# EasyEDA Pro project hanger0515.eprj

# Schematic Schematic1
Create Date: 2024-05-15; Page Name: P1; Project Name: hanger0515; Schematic Name: Schematic1; Update Date: 2024-05-15; Company: 嘉立创EDA; Page Size: A4; Version: V1.0
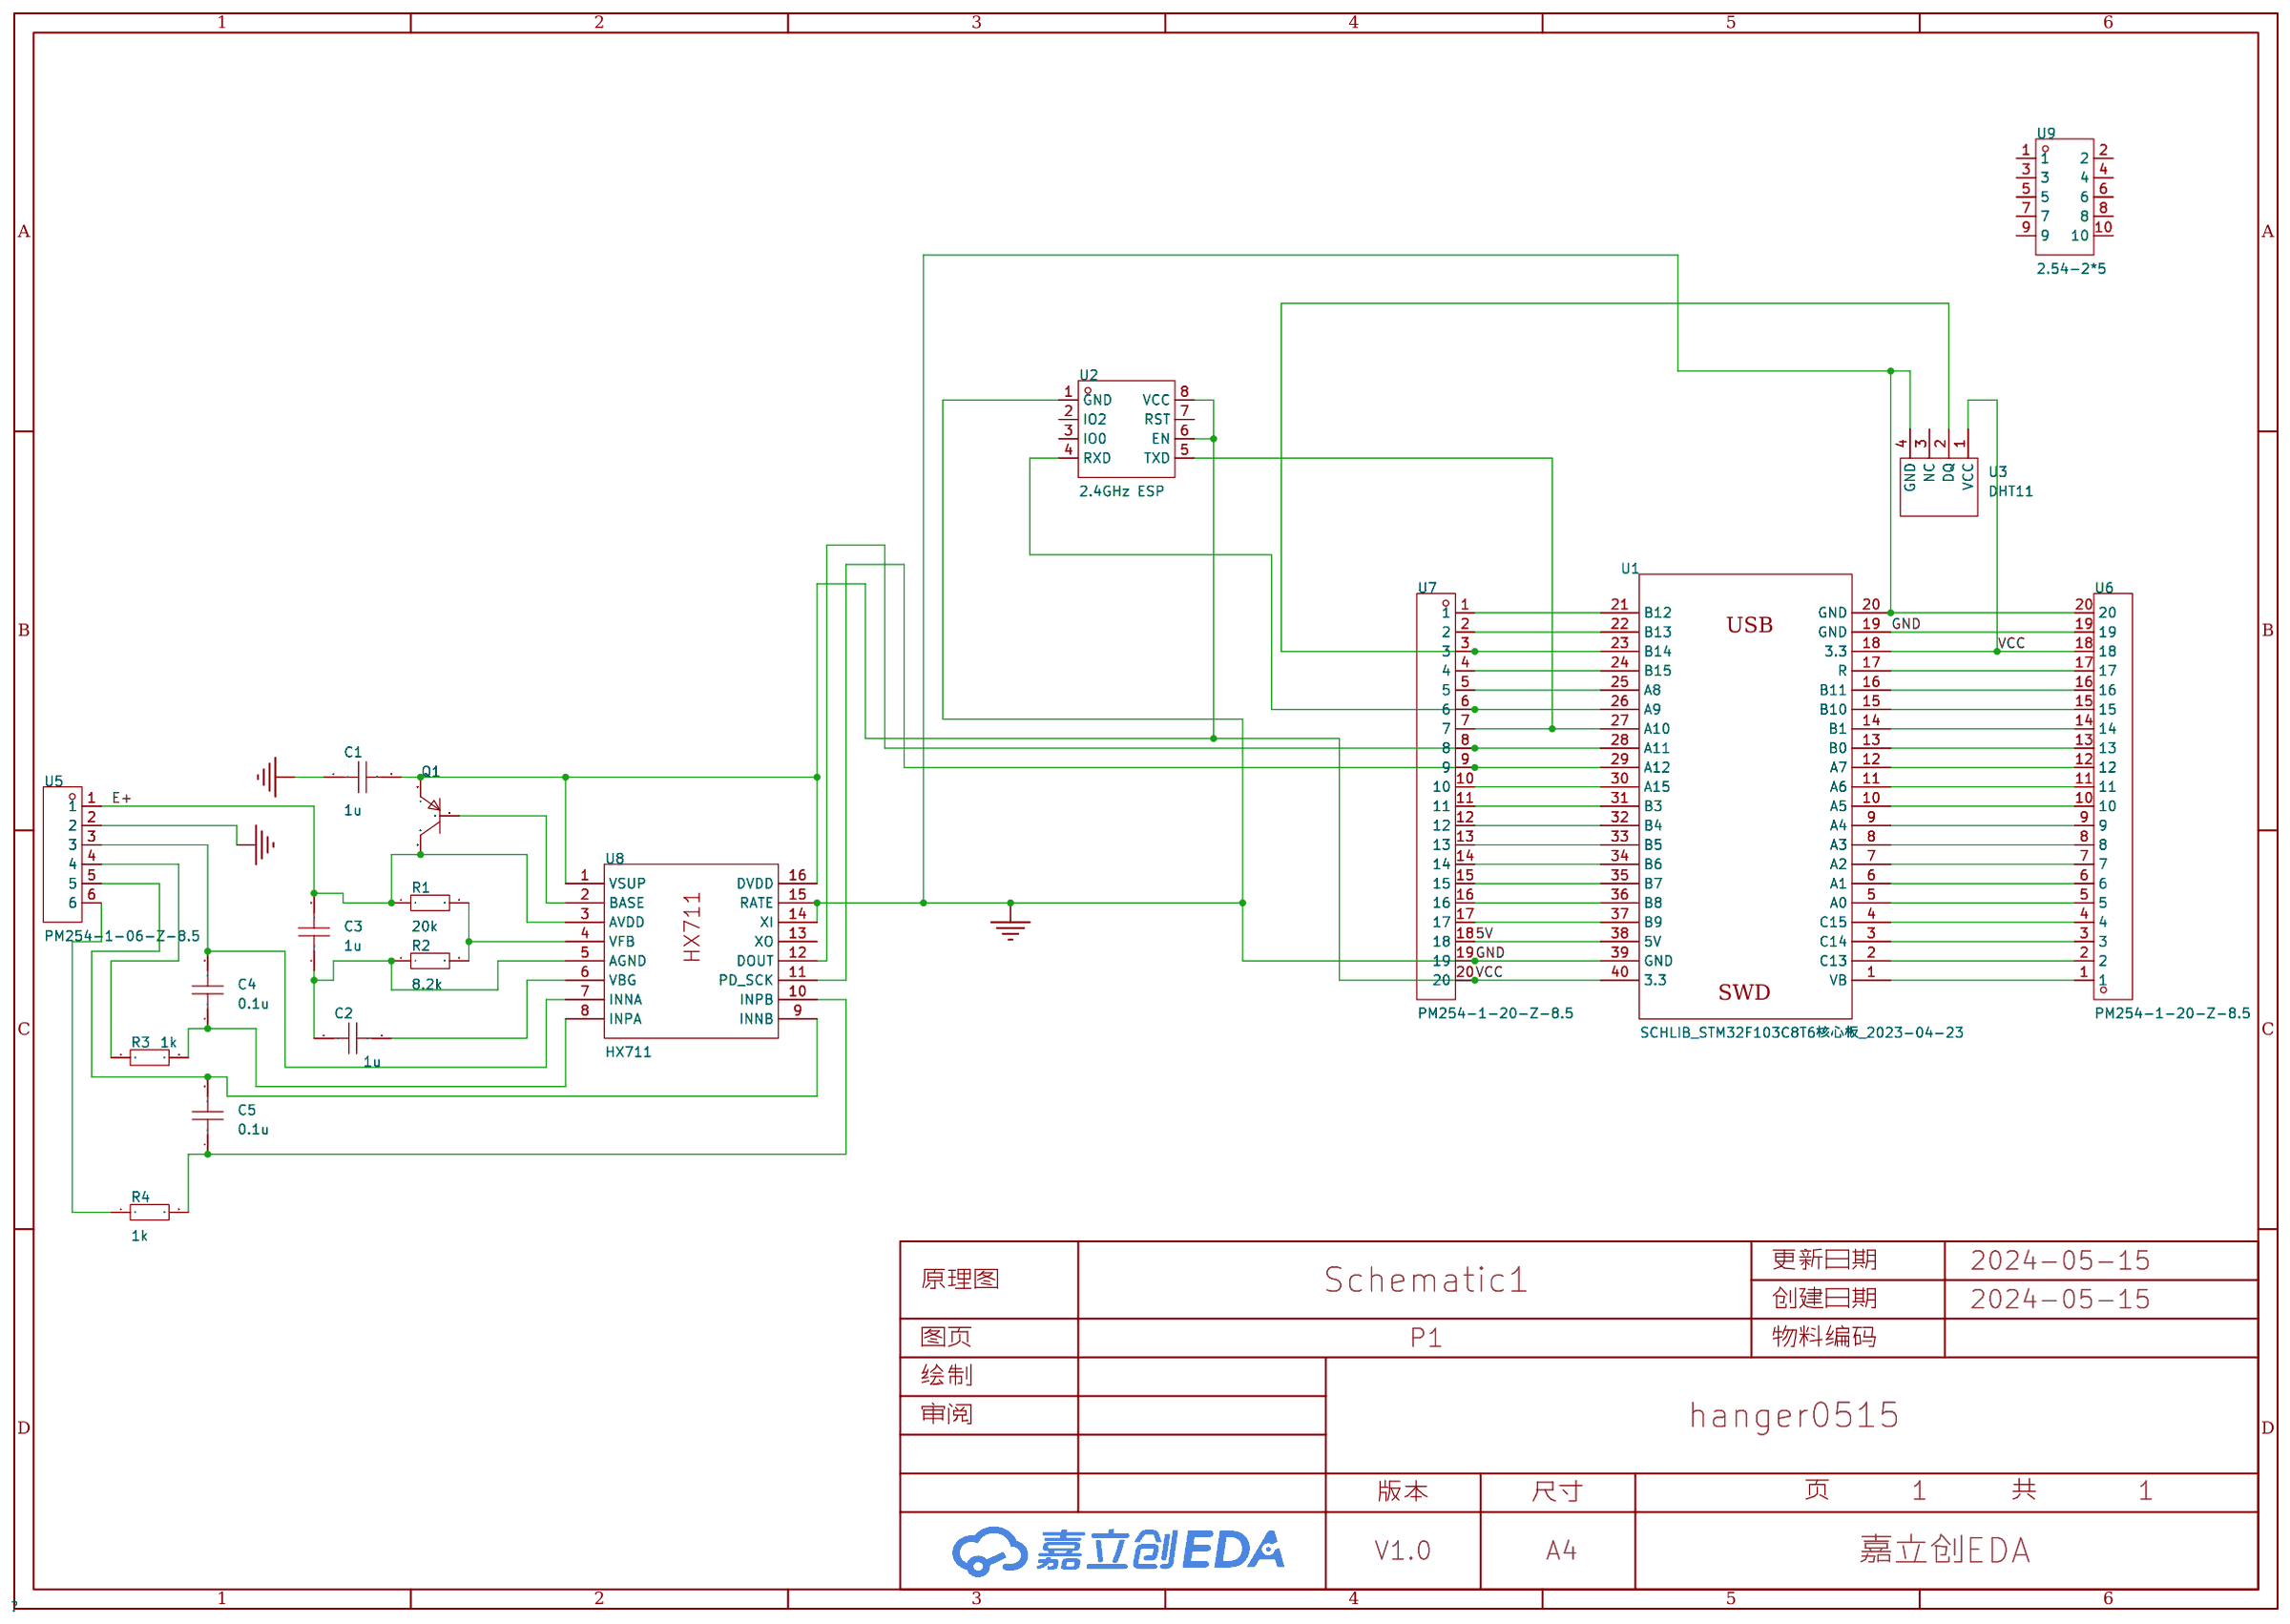
[diagram p0: schematic sheet]

## Parts
C1  1u  [C0603]
C2  1u  [C0603]
C3  1u  [C0603]
C4  0.1u  [C0603]
C5  0.1u  [C0603]
Q1  -  [S8550P_SOT]
R1  20k  [R0603]
R2  8.2k  [R0603]
R3  1k  [R0603]
R4  1k  [R0603]
U1  SCHLIB_STM32F103C8T6核心板_2023-04-23  [STM32F103C8T6核心板 STM32开发板ARM嵌入式单片机小系统实验板]
U2  2.4GHz ESP  [WIFIM-TH_8P-L24.7-W14.4-P2.54]
U3  DHT11  [DHT11]
U5  PM254-1-06-Z-8.5  [HDR-TH_6P-P2.54-V-F]
U6  PM254-1-20-Z-8.5  [HDR-TH_20P-P2.54-V-F-2]
U7  PM254-1-20-Z-8.5  [HDR-TH_20P-P2.54-V-F-2]
U8  HX711  [SOP-16_L10.0-W3.9-P1.27-LS6.0-BL]
U9  2.54-2*5  [HDR-TH_10P-P2.54-V-F-R2-C5-S2.54]

## Library data of the parts
C1-C5 = CAP_0603: Supplier Footprint: 0603
Q1 = S8550_SOT_PNP: Supplier Footprint: SOT-23
R1-R4 = Res_0603: Supplier Footprint: 0603
U1 = SCHLIB_STM32F103C8T6核心板_2023-04-23: link: https://item.taobao.com/item.htm?spm=a1z0d.7625083.1998302264.6.5c5f4e69XYSnTr&id=620064088112
U2 = ESP-01: 核心处理器:-;频率:2.4GHz;天线形式:板载PCB天线;发射功率:16dBm;接收灵敏度:-90dBm;; LCSC Part Name: 体积超小的802.11b/g/nWi-FiSOC模块; Supplier Part: C503581; Manufacturer: Ai-Thinker(安信可); JLCPCB Part Class: Extended Part; Datasheet: https://atta.szlcsc.com/upload/public/pdf/source/20200407/C503581_BFDAA19F4B592DB0CEE4D61B6918C625.pdf; Supplier: LCSC; Support Interface: GPIO；UART; Antenna Type: 板载PCB天线; Output Power: 16dBm; Operating Voltage: 3V~3.6V; Sensitivity: -90dBm; Operating Temperature: -20℃~+85℃
U3 = DHT11: _: undefined
U5 = PM254-1-06-Z-8.5: 插孔结构:1x6P;间距:2.54mm;行距:-;圆孔/方孔:方孔;安装类型:直插;排数:单排;总孔位数:6P;额定电流:3A;额定电压:-;插孔方向:顶部;塑高:8.5mm;触头材质:铜合金;工作温度范围:-40℃~+105℃;焊接温度(最大值):260℃@5S;; LCSC Part Name: 1x6P 间距:2.54mm 直插; Supplier Part: C2897369; Manufacturer: HCTL(华灿天禄); Supplier Footprint: 插件,P=2.54mm; JLCPCB Part Class: Extended Part; Datasheet: https://atta.szlcsc.com/upload/public/pdf/source/20230609/534BE42964C679BDE98E061007C4ABD6.pdf; Supplier: LCSC; Holes Structure: 1x6P; Pitch: 2.54mm; Circular Hole / Square Hole: 方孔; Mounting Type: 直插; Number of Rows: 单排; Number of Holes: 6P; Current Rating (Max): 3A; Holes Direction: 顶部; Insulation Height: 8.5mm; Contact Material: 铜合金; Operating Temperature Range: -40℃~+105℃; Soldering Temperature(Max): 260℃@5S
U6 U7 = PM254-1-20-Z-8.5: 插孔结构:1x20P;间距:2.54mm;行距:-;圆孔/方孔:方孔;安装类型:直插;排数:单排;总孔位数:20P;额定电流:3A;额定电压:-;插孔方向:顶部;塑高:8.5mm;触头材质:铜合金;工作温度范围:-40℃~+105℃;焊接温度(最大值):260℃@5S;; LCSC Part Name: 1x20P 间距:2.54mm 直插; Supplier Part: C2897383; Manufacturer: HCTL(华灿天禄); Supplier Footprint: 插件,P=2.54mm; JLCPCB Part Class: Extended Part; Datasheet: https://atta.szlcsc.com/upload/public/pdf/source/20230609/534BE42964C679BDE98E061007C4ABD6.pdf; Supplier: LCSC; Holes Structure: 1x20P; Pitch: 2.54mm; Circular Hole / Square Hole: 方孔; Mounting Type: 直插; Number of Rows: 单排; Number of Holes: 20P; Current Rating (Max): 3A; Holes Direction: 顶部; Insulation Height: 8.5mm; Contact Material: 铜合金; Operating Temperature Range: -40℃~+105℃; Soldering Temperature(Max): 260℃@5S
U8 = HX711: 称重AD采集芯片; Supplier Part: C43656; Manufacturer: AVIA(海芯科技); Supplier Footprint: SOP-16; JLCPCB Part Class: Extended Part; Datasheet: https://atta.szlcsc.com/upload/public/pdf/source/20201105/C43656_14FD91CAE53E7DB415D03EABCB162D83.pdf; Supplier: LCSC
U9 = 2.54-2*5: 插孔结构:2x5P;间距:2.54mm;行距:2.54mm;圆孔/方孔:方孔;安装类型:直插;排数:双排;总孔位数:10P;额定电流:2.5A;额定电压:-;插孔方向:顶部;塑高:8.5mm;工作温度范围:-40℃~+105℃;; LCSC Part Name: 间距:2.54mm 2x5P 直插; Supplier Part: C2977587; Manufacturer: ZHOURI(洲日); Supplier Footprint: 插件,P=2.54mm; JLCPCB Part Class: Extended Part; Datasheet: https://atta.szlcsc.com/upload/public/pdf/source/20220328/53961E697C4FF664B69BABFADEC8B830.pdf; Supplier: LCSC; Holes Structure: 2x5P; Pitch: 2.54mm; Row Spacing: 2.54mm; Circular Hole / Square Hole: 方孔; Mounting Type: 直插; Number of Rows: 双排; Number of Holes: 10P; Current Rating (Max): 2.5A; Holes Direction: 顶部; Insulation Height: 8.5mm; Operating Temperature Range: -40℃~+105℃

## Nets
5V: U1.38(5V) U7.18
GND: C1.1 U1.19(GND) U1.20(GND) U1.39(GND) U2.1(GND) U3.4(GND) U5.2 U6.19 U6.20 U7.19 U8.14(XI) U8.15(RATE)
VCC: C1.2 Q1.2(E) U1.18(3.3) U1.40(3.3) U2.6(EN) U2.8(VCC) U3.1(VCC) U6.18 U7.20 U8.1(VSUP) U8.16(DVDD)
E+: C3.2 Q1.3(C) R1.1 U5.1 U8.3(AVDD)
$1N591: U1.23(B14) U3.2(DQ) U7.3
$1N598: U1.1(VB) U6.1
$1N599: U1.2(C13) U6.2
$1N600: U1.3(C14) U6.3
$1N601: U1.4(C15) U6.4
$1N602: U1.5(A0) U6.5
$1N603: U1.6(A1) U6.6
$1N604: U1.7(A2) U6.7
$1N605: U1.8(A3) U6.8
$1N606: U1.9(A4) U6.9
$1N607: U1.10(A5) U6.10
$1N608: U1.11(A6) U6.11
$1N609: U1.12(A7) U6.12
$1N610: U1.13(B0) U6.13
$1N611: U1.14(B1) U6.14
$1N612: U1.15(B10) U6.15
$1N613: U1.16(B11) U6.16
$1N614: U1.17(R) U6.17
$1N623: U1.26(A9) U2.4(RXD) U7.6
$1N624: U1.21(B12) U7.1
$1N625: U1.22(B13) U7.2
$1N626: U1.24(B15) U7.4
$1N627: U1.25(A8) U7.5
$1N628: U1.30(A15) U7.10
$1N629: U1.31(B3) U7.11
$1N630: U1.32(B4) U7.12
$1N631: U1.33(B5) U7.13
$1N632: U1.34(B6) U7.14
$1N633: U1.35(B7) U7.15
$1N635: U1.27(A10) U2.5(TXD) U7.7
$1N641: U1.36(B8) U7.16
$1N660: U1.37(B9) U7.17
$1N2019: Q1.1(B) U8.2(BASE)
$1N2037: R1.2 R2.2 U8.4(VFB)
$1N2057: C2.2 U8.6(VBG)
$1N2062: C2.1 C3.1 R2.1 U8.5(AGND)
$1N2095: C4.1 R3.2 U8.8(INPA)
$1N2099: C5.1 R4.2 U8.10(INPB)
$1N2122: C4.2 U5.3 U8.7(INNA)
$1N2126: R3.1 U5.4
$1N2137: C5.2 U5.5 U8.9(INNB)
$1N2144: R4.1 U5.6
$1N2211: U1.29(A12) U7.9 U8.11(PD_SCK)
$1N2222: U1.28(A11) U7.8 U8.12(DOUT)

Not connected (* = marked no-connect by the designer): U2 2(IO2) 3(IO0) 7(RST); U3 3(NC); U8 13(XO); U9 1 2 3 4 5 6 7 8 9 10

# Board PCB1
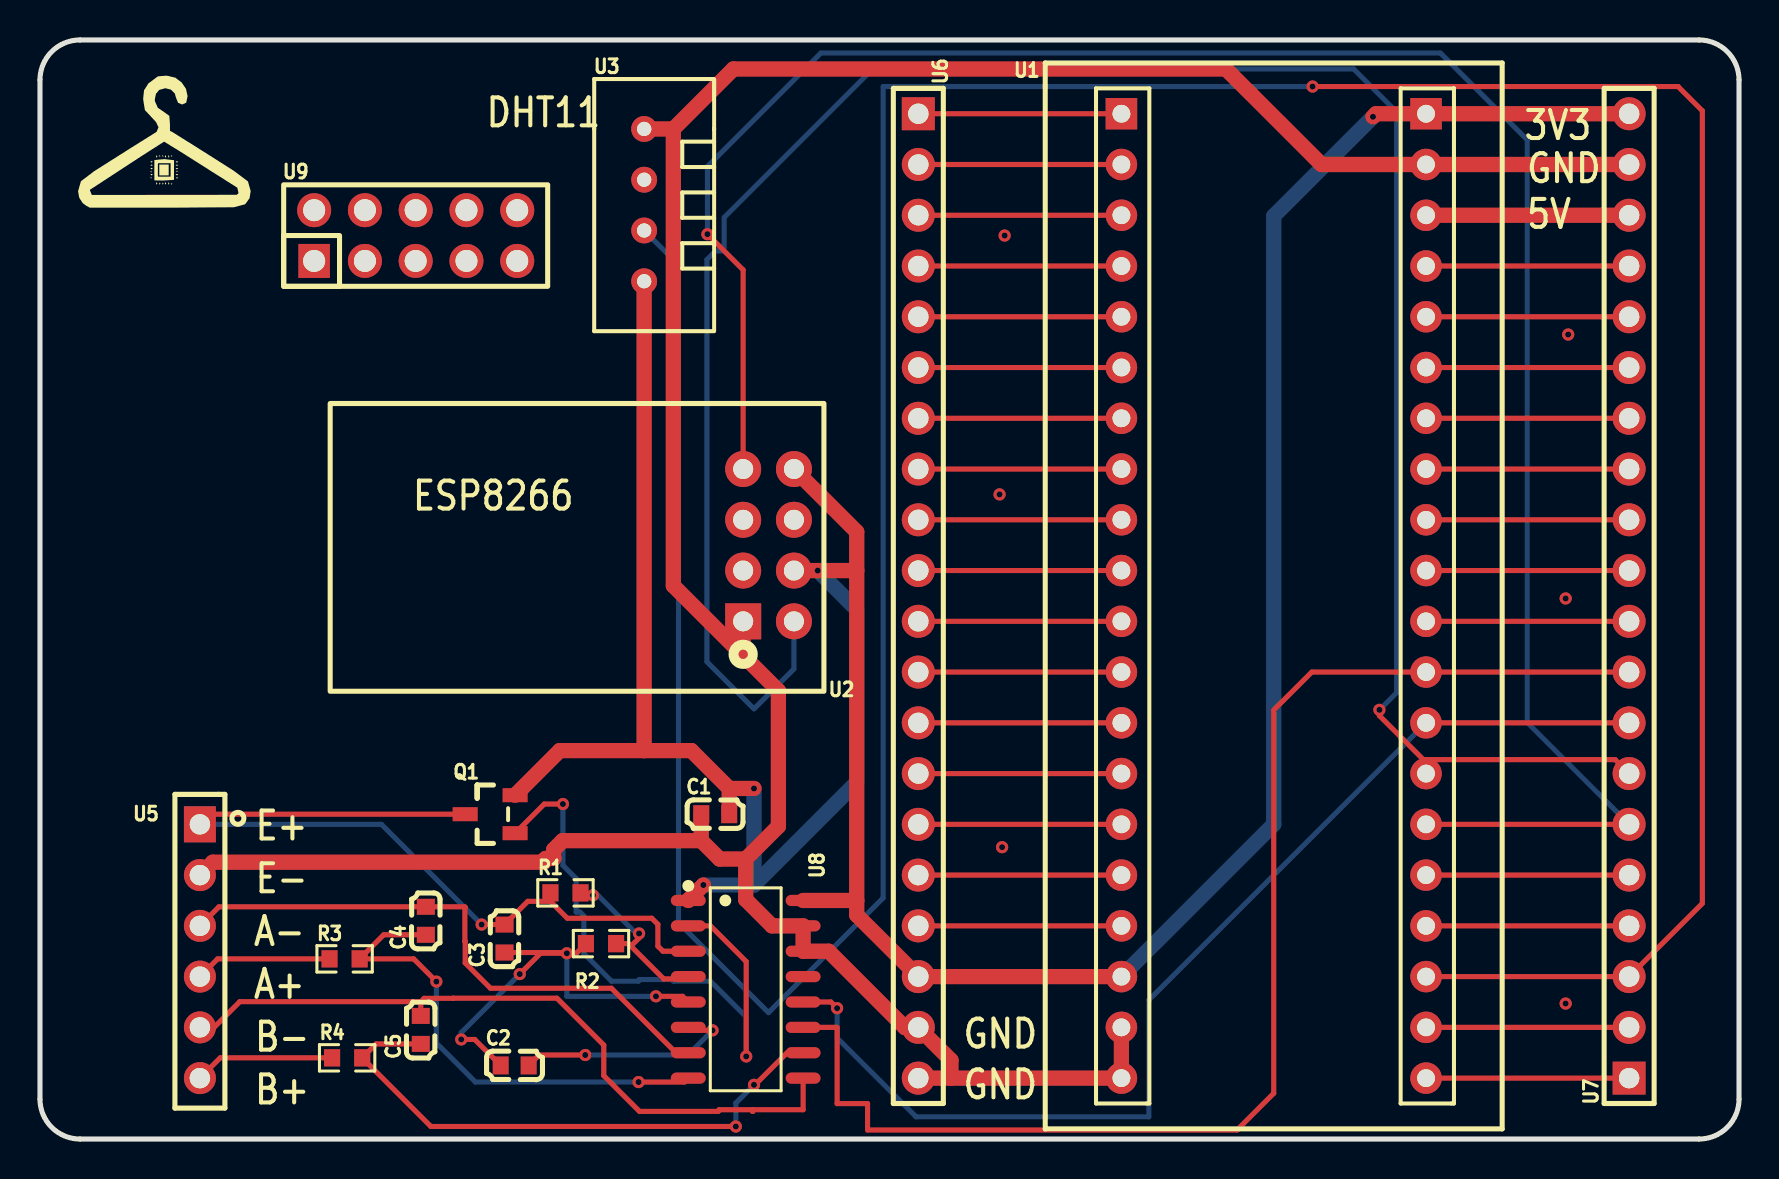
[diagram p1: board, top side]
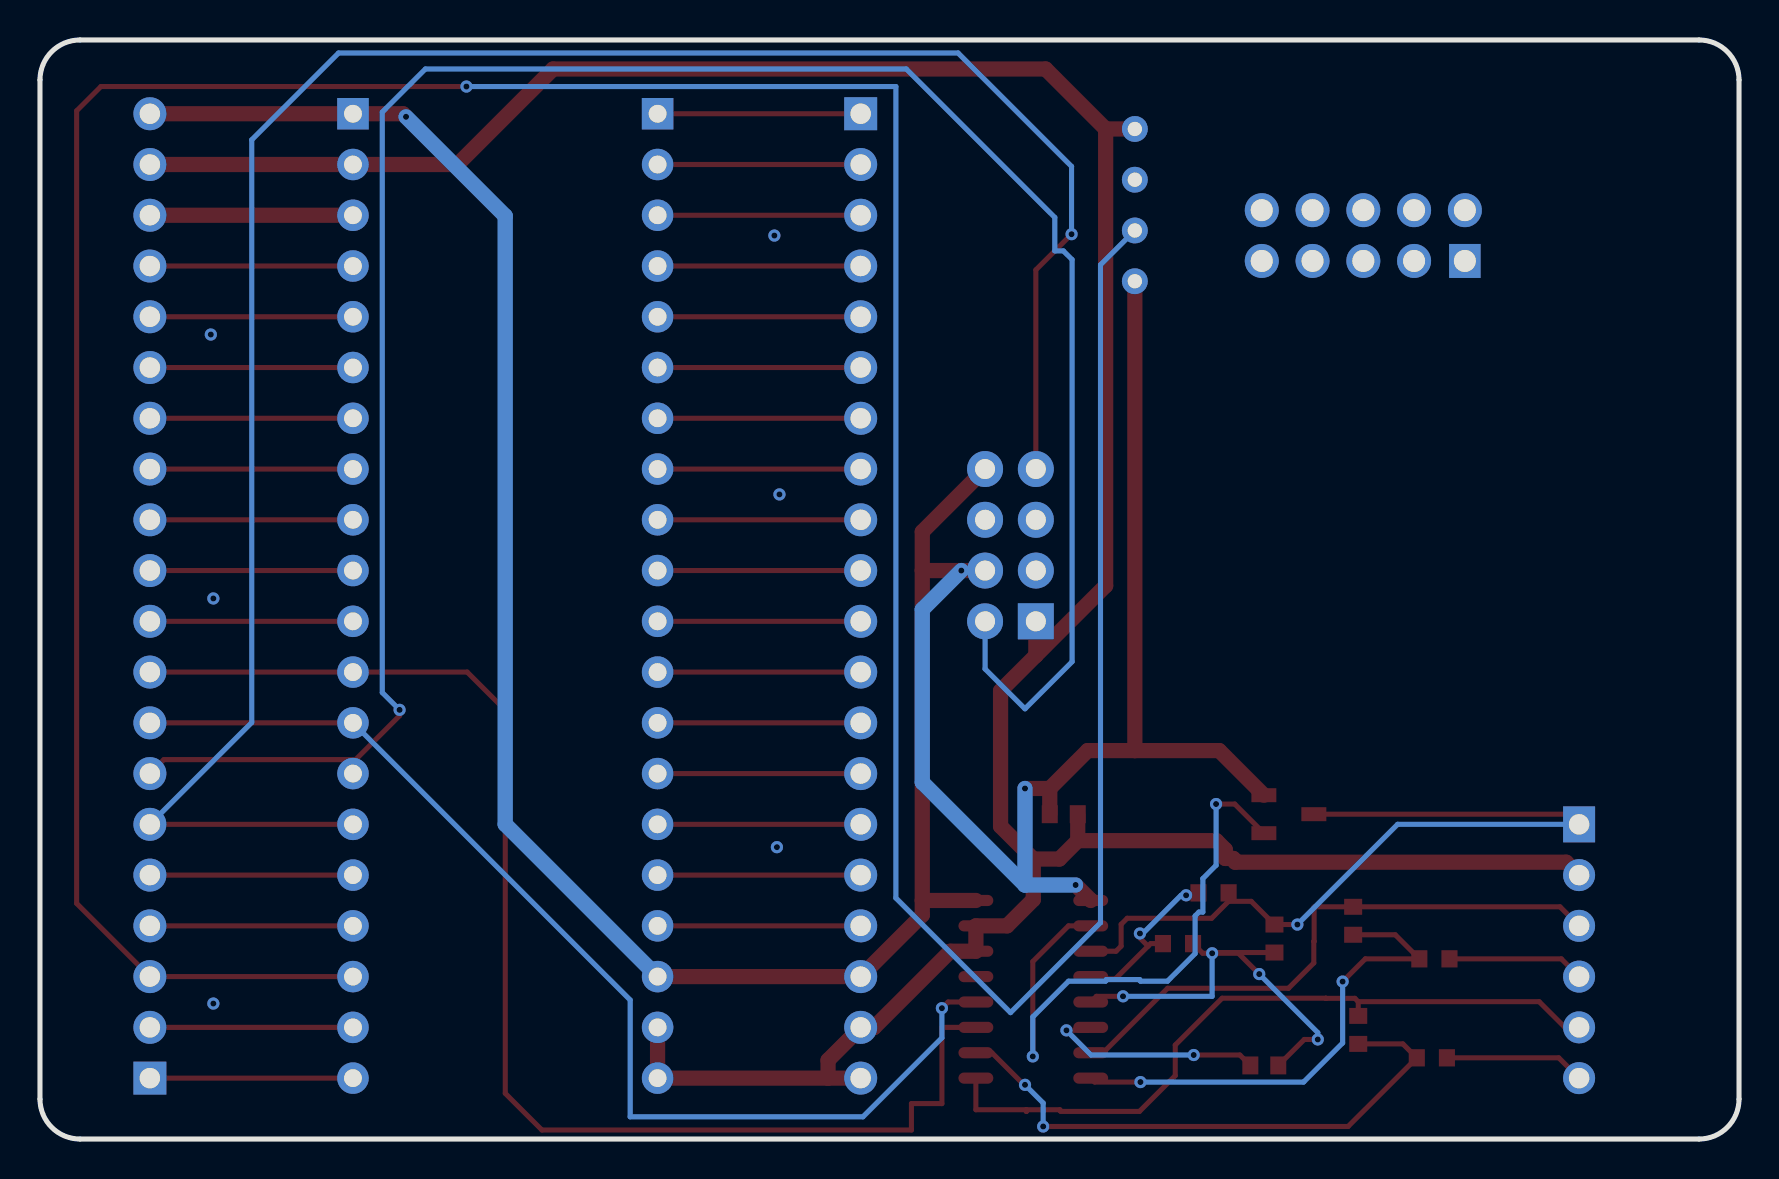
[diagram p2: board, bottom side, seen from below]

Outline 85 x 55 mm; copper layers: Top Layer, Bottom Layer. Coordinates in mm from the lower left corner of the outline.
Outline path: 0,53 0,2 arc(0.59,0.59) 2,0 83,0 arc(84.41,0.59) 85,2 85,53 arc(84.41,54.41) 83,55 2,55 arc(0.59,54.41) 0,53
Stack: Top Layer 0.035mm / Dielectric1 1.51mm FR4 er 4.5 / Bottom Layer 0.035mm

## Design rules (mm)
template: 自定义配置
spacing copperThickness1oz (default): track to track 0.203, other pairs 0.203 to 0.203
spacing copperThickness2oz: track to track 0.203, other pairs 0.152 to 0.3
track width copperThickness1oz (default): min 0.254, default 0.254, max 0.762
track width copperThickness2oz: min 0.203, default 0.254, max 2.54
track width VCCandGND: min 0.254, default 0.762, max 0.762
differential pair differentialPair (default): width min 0.127, default 0.254, max 2.54; gap min 0.152, default 0.152
via viaSize (default): diameter min 0.5, default 0.61, max 10; hole min 0.3, default 0.305, max 6.299
net GND uses VCCandGND
net VCC uses VCCandGND
net 5V uses VCCandGND

## Placement (name value [footprint] x y rotation side)
C1  1u  [C0603]  33.78 16.26 0 top
C2  1u  [C0603]  23.75 3.68 0 top
C3  1u  [C0603]  23.24 10.03 90 top
C4  0.1u  [C0603]  19.3 10.92 90 top
C5  0.1u  [C0603]  19.05 5.46 90 top
Q1  -  [S8550P_SOT]  22.48 16.26 0 top
R1  20k  [R0603]  26.29 12.32 0 top
R2  8.2k  [R0603]  28.07 9.78 0 top
R3  1k  [R0603]  15.24 9.02 0 top
R4  1k  [R0603]  15.37 4.06 0 top
U1  SCHLIB_STM32F103C8T6核心板_2023-04-23  [STM32F103C8T6核心板 STM32开发板ARM嵌入式单片机小系统实验板]  54.1 51.31 0 top
U2  2.4GHz ESP  [WIFIM-TH_8P-L24.7-W14.4-P2.54]  36.45 29.72 180 top
U3  -  [DHT11]  30.23 46.74 0 top
U5  PM254-1-06-Z-8.5  [HDR-TH_6P-P2.54-V-F]  8 9.4 270 top
U6  PM254-1-20-Z-8.5  [HDR-TH_20P-P2.54-V-F-2]  43.94 27.18 270 top
U7  PM254-1-20-Z-8.5  [HDR-TH_20P-P2.54-V-F-2]  79.5 27.18 90 top
U8  HX711  [SOP-16_L10.0-W3.9-P1.27-LS6.0-BL]  35.31 7.49 270 top
U9  2.54-2*5  [HDR-TH_10P-P2.54-V-F-R2-C5-S2.54]  18.8 45.21 0 top

## Footprints (pads in the part's own frame, mm; a bottom-side part is the same pattern mirrored in y, then rotated)
C0603
  rect 0.8x0.9 smd: 1(-0.7,0) 2(0.7,0)
DHT11
  round 1.296 hole 0.711: 1(0,-3.81) 2(0,-1.27) 3(0,1.27) 4(0,3.81)
HDR-TH_6P-P2.54-V-F
  rect 1.8x1.6 hole 1.02: 1(-6.35,0)
  round 1.6 hole 1.02: 2(-3.81,0) 3(-1.27,0) 4(1.27,0) 5(3.81,0) 6(6.35,0)
HDR-TH_10P-P2.54-V-F-R2-C5-S2.54
  rect 1.575x1.7 hole 1.1: 1(-5.08,-1.27)
  round 1.7 hole 1.1: 2(-5.08,1.27) 3(-2.54,-1.27) 4(-2.54,1.27) 5(0,-1.27) 6(0,1.27) 7(2.54,-1.27) 8(2.54,1.27) 9(5.08,-1.27) 10(5.08,1.27)
HDR-TH_20P-P2.54-V-F-2
  rect 1.65x1.65 hole 1.02: 1(-24.13,0)
  round 1.65 hole 1.02: 2(-21.59,0) 3(-19.05,0) 4(-16.51,0) 5(-13.97,0) 6(-11.43,0) 7(-8.89,0) 8(-6.35,0) 9(-3.81,0) 10(-1.27,0) 11(1.27,0) 12(3.81,0) 13(6.35,0) 14(8.89,0) 15(11.43,0) 16(13.97,0) 17(16.51,0) 18(19.05,0) 19(21.59,0) 20(24.13,0)
R0603
  rect 0.806x0.864 smd: 1(-0.753,0) 2(0.753,0)
S8550P_SOT
  rect 1.25x0.701 smd: 1(1.292,-0.95) 2(1.292,0.95) 3(-1.208,0)
SOP-16_L10.0-W3.9-P1.27-LS6.0-BL
  oval 0.56x1.745 smd: 1(-4.445,-2.873) 2(-3.175,-2.873) 3(-1.905,-2.873) 4(-0.635,-2.873) 5(0.635,-2.873) 6(1.905,-2.873) 7(3.175,-2.873) 8(4.445,-2.873) 9(4.445,2.873) 10(3.175,2.873) 11(1.905,2.873) 12(0.635,2.873) 13(-0.635,2.873) 14(-1.905,2.873) 15(-3.175,2.873) 16(-4.445,2.873)
STM32F103C8T6核心板 STM32开发板ARM嵌入式单片机小系统实验板
  rect 1.575x1.575 hole 0.889: 1(0,0) 40(15.24,0)
  round 1.575 hole 0.889: 2(0,-2.54) 3(0,-5.08) 4(0,-7.62) 5(0,-10.16) 6(0,-12.7) 7(0,-15.24) 8(0,-17.78) 9(0,-20.32) 10(0,-22.86) 11(0,-25.4) 12(0,-27.94) 13(0,-30.48) 14(0,-33.02) 15(0,-35.56) 16(0,-38.1) 17(0,-40.64) 18(0,-43.18) 19(0,-45.72) 20(0,-48.26) 21(15.24,-48.26) 22(15.24,-45.72) 23(15.24,-43.18) 24(15.24,-40.64) 25(15.24,-38.1) 26(15.24,-35.56) 27(15.24,-33.02) 28(15.24,-30.48) 29(15.24,-27.94) 30(15.24,-25.4) 31(15.24,-22.86) 32(15.24,-20.32) 33(15.24,-17.78) 34(15.24,-15.24) 35(15.24,-12.7) 36(15.24,-10.16) 37(15.24,-7.62) 38(15.24,-5.08) 39(15.24,-2.54)
WIFIM-TH_8P-L24.7-W14.4-P2.54
  rect 1.8x1.8 hole 1: 1(1.27,3.81)
  round 1.8 hole 1: 2(1.27,1.27) 3(1.27,-1.27) 4(1.27,-3.81) 5(-1.27,3.81) 6(-1.27,1.27) 7(-1.27,-1.27) 8(-1.27,-3.81)

## Nets
As in the schematic.

Pads without a net: U2 2 3 7; U3 3; U8 13; U9 1 2 3 4 5 6 7 8 9 10

## Via types
v1: diameter 0.61, hole 0.305, Top Layer to Bottom Layer, 29 vias

## Routing (per net, layer and track width the routed paths; a pad name or vN(x,y) marks a point on that pad's centre or on a via; arc(x,y) is an arc through that point)
5V: length 10.2
  Top Layer w0.762: U1.38 U7.18
GND: length 153.6
  Top Layer w0.762: 35.31,14.01 34,14.01 33.08,14.93 ; 35.31,14.01 36.94,15.65 36.94,22.43 35.18,24.19 ; 35.31,14.01 35.31,11.98 36.62,10.67 U8.15 U8.14 39.46,9.4 43.28,5.58 43.94,5.58 ; U5.2 8.65,13.85 25.21,13.85 25.21,13.95 25.3,14.04 25.7,14.04 25.7,14.49 26.15,14.93 33.08,14.93 ; 35.18,24.19 31.69,27.69 31.69,50.55 ; 35.18,24.19 U2.1 ; 43.94,5.58 U6.19 ; 43.94,5.58 45.57,3.94 45.57,3.05 ; 33.08,14.93 C1.1 ; U7.19 U1.39 64.11,48.77 59.33,53.55 34.69,53.55 31.69,50.55 ; 45.57,3.05 U6.20 ; 45.57,3.05 U1.20 U1.19 ; 31.69,50.55 U3.4
  vias: v1(48.01,32.26) v1(48.13,14.6) v1(48.26,45.21) v1(76.33,27.05) v1(76.33,6.78) v1(76.45,40.26)
VCC: length 170.6
  Top Layer w0.762: v1(66.69,51.16) 66.84,51.31 U1.40 U7.20 ; 40.86,11.94 40.86,11.21 U6.18 U1.18 ; 40.86,11.94 40.86,28.45 ; 40.86,11.94 U8.16 ; 40.86,28.45 v1(38.91,28.45) U2.6 ; 40.86,28.45 40.86,30.39 U2.8 ; v1(35.72,17.54) 34.48,17.54 ; 34.48,17.54 C1.2 ; 34.48,17.54 32.59,19.44 30.23,19.44 ; 30.23,19.44 U3.1 ; 30.23,19.44 26,19.44 Q1.2 ; v1(33.19,12.71) 32.43,11.96 U8.1
  Bottom Layer w0.762: v1(66.69,51.16) 61.73,46.19 61.73,15.75 U1.18 ; v1(33.19,12.71) 35.72,12.71 ; 35.72,12.71 40.86,17.85 40.86,26.5 v1(38.91,28.45) ; 35.72,12.71 v1(35.72,17.54)
E+: length 42.6
  Top Layer w0.254: R1.1 25.54,11.89 ; 25.54,11.89 24.4,11.89 C3.2 v1(22.1,10.73) ; 25.54,11.89 26.38,11.05 30.61,11.05 30.91,10.74 30.91,9.65 31.17,9.4 U8.3 ; Q1.3 8.51,16.26 U5.1
  Bottom Layer w0.254: U5.1 17.08,15.75 v1(22.1,10.73)
$1N591: length 186.9
  Top Layer w0.254: v1(63.67,52.67) 81.95,52.67 83.17,51.45 83.17,11.79 U7.3 U1.23
  Bottom Layer w0.254: v1(63.67,52.67) 42.18,52.67 42.18,12.06 36.44,6.33 31.94,10.83 31.94,43.75 U3.2
$1N598: length 10.2
  Top Layer w0.254: U1.1 U6.1
$1N599: length 10.2
  Top Layer w0.254: U1.2 U6.2
$1N600: length 10.2
  Top Layer w0.254: U1.3 U6.3
$1N601: length 10.2
  Top Layer w0.254: U1.4 U6.4
$1N602: length 10.2
  Top Layer w0.254: U1.5 U6.5
$1N603: length 10.2
  Top Layer w0.254: U1.6 U6.6
$1N604: length 10.2
  Top Layer w0.254: U1.7 U6.7
$1N605: length 10.2
  Top Layer w0.254: U1.8 U6.8
$1N606: length 10.2
  Top Layer w0.254: U1.9 U6.9
$1N607: length 10.2
  Top Layer w0.254: U1.10 U6.10
$1N608: length 10.2
  Top Layer w0.254: U1.11 U6.11
$1N609: length 10.2
  Top Layer w0.254: U1.12 U6.12
$1N610: length 10.2
  Top Layer w0.254: U1.13 U6.13
$1N611: length 10.2
  Top Layer w0.254: 54.1,18.29 U6.14
$1N612: length 10.2
  Top Layer w0.254: U1.15 U6.15
$1N613: length 10.2
  Top Layer w0.254: U1.16 U6.16
$1N614: length 10.2
  Top Layer w0.254: U1.17 U6.17
$1N623: length 107.6
  Top Layer w0.254: U2.4 35.18,43.49 v1(33.39,45.28) ; U1.26 U7.6
  Bottom Layer w0.254: U7.6 74.41,20.84 74.41,50 70.06,54.35 39.07,54.35 33.39,48.67 v1(33.39,45.28)
$1N624: length 10.2
  Top Layer w0.254: U1.21 U7.1
$1N625: length 10.2
  Top Layer w0.254: U1.22 U7.2
$1N626: length 10.2
  Top Layer w0.254: U1.24 U7.4
$1N627: length 10.2
  Top Layer w0.254: U1.25 U7.5
$1N628: length 10.2
  Top Layer w0.254: U1.30 U7.10
$1N629: length 10.2
  Top Layer w0.254: U1.31 U7.11
$1N630: length 10.2
  Top Layer w0.254: U1.32 U7.12
$1N631: length 10.2
  Top Layer w0.254: U1.33 U7.13
$1N632: length 10.2
  Top Layer w0.254: U1.34 U7.14
$1N633: length 10.2
  Top Layer w0.254: U1.35 U7.15
$1N635: length 114
  Top Layer w0.254: 69.34,18.29 69.34,18.99 ; 69.34,18.99 78.8,18.99 U7.7 ; 69.34,18.99 69.21,18.99 67.01,21.18 v1(67.01,21.48)
  Bottom Layer w0.254: v1(67.01,21.48) 67.87,22.34 67.87,51.39 65.72,53.55 41.66,53.55 34.23,46.12 34.23,44.44 33.8,44.44 33.37,44.01 33.37,23.88 35.72,21.53 37.72,23.53 U2.5
$1N641: length 10.2
  Top Layer w0.254: U1.36 U7.16
$1N660: length 10.2
  Top Layer w0.254: U1.37 U7.17
$1N2019: length 30.9
  Top Layer w0.254: U8.2 33.54,10.67 35.33,8.88 v1(35.33,4.13) ; v1(26.16,16.76) 25.23,16.76 Q1.1
  Bottom Layer w0.254: v1(35.33,4.13) 35.33,6.11 33.54,7.9 31.7,7.9 31.66,7.94 31.66,7.98 29.98,7.98 29.98,7.94 29.94,7.9 28.59,7.9 27.21,9.28 27.21,11.17 27.02,11.36 26.82,11.36 26.82,13.04 26.16,13.7 v1(26.16,16.76)
$1N2037: length 9
  Top Layer w0.254: U8.4 32.32,8.01 31.2,8.01 29.56,9.65 ; 29.56,9.65 29.44,9.78 R2.2 ; 29.56,9.65 29.97,10.06 v1(29.97,10.29) ; R1.2 27.16,12.2 v1(27.66,12.2)
  Bottom Layer w0.254: v1(27.66,12.2) 27.92,12.2 29.83,10.29 v1(29.97,10.29)
$1N2057: length 11.2
  Top Layer w0.254: 24.45,3.68 24.97,4.2 v1(27.28,4.2) ; v1(33.65,5.44) 32.58,5.44 U8.6
  Bottom Layer w0.254: v1(33.65,5.44) 32.41,4.2 v1(27.28,4.2)
$1N2062: length 22.4
  Top Layer w0.254: v1(30.82,7.14) 32.15,7.14 U8.5 ; v1(26.36,9.3) 25.04,9.3 v1(24,8.25) ; v1(26.36,9.3) 26.32,9.33 C3.1 ; v1(26.36,9.3) 26.83,9.3 R2.1 ; C2.1 21.75,4.98 v1(21.07,4.98)
  Bottom Layer w0.254: v1(21.07,4.98) 21.07,5.33 v1(24,8.25) ; v1(26.36,9.3) 26.36,7.14 v1(30.82,7.14)
$1N2095: length 24.7
  Top Layer w0.254: v1(19.83,7.88) 18.69,9.02 R3.2 17.2,10.22 C4.1 ; v1(29.95,2.85) 32.24,2.85 U8.8
  Bottom Layer w0.254: v1(19.83,7.88) 19.83,4.8 21.78,2.85 v1(29.95,2.85)
$1N2099: length 28.9
  Top Layer w0.254: C5.1 16.82,4.76 R4.2 19.56,0.63 v1(34.81,0.63) ; 38.18,4.32 37.38,4.32 35.77,2.71 v1(35.72,2.71)
  Bottom Layer w0.254: v1(34.81,0.63) 34.81,1.8 v1(35.72,2.71)
$1N2122: length 29.5
  Top Layer w0.254: U5.3 8.95,11.62 21.25,11.62 21.27,11.6 21.27,11.58 21.27,11.57 21.26,11.57 21.26,9.89 21.27,9.89 21.27,9.89 21.27,8.81 22.54,7.55 28.59,7.55 31.81,4.32 32.43,4.32
$1N2126: length 6.9
  Top Layer w0.254: U5.4 8.89,9.02 R3.1
$1N2137: length 36.5
  Top Layer w0.254: 19.05,6.87 C5.2 ; 19.05,6.87 19.22,7.04 20.67,7.04 20.67,7.05 25.86,7.05 28.2,4.7 28.2,3.17 29.99,1.38 33.93,1.38 33.97,1.43 33.97,1.47 35.65,1.47 35.65,1.38 35.66,1.38 35.66,1.47 38.18,1.47 U8.9 ; 19.05,6.87 10,6.87 8.71,5.59 U5.5
$1N2144: length 7
  Top Layer w0.254: R4.1 9.02,4.06 U5.6
$1N2211: length 67.2
  Top Layer w0.254: U8.11 39.88,5.59 39.88,1.77 41.4,1.77 41.4,0.45 59.89,0.45 61.72,2.29 61.72,21.46 63.63,23.37 U1.29 U7.9
$1N2222: length 56.2
  Top Layer w0.254: v1(39.88,6.55) 39.57,6.86 U8.12 ; U1.28 U7.8
  Bottom Layer w0.254: U1.28 55.47,6.96 55.47,1.11 43.83,1.11 39.88,5.06 v1(39.88,6.55)

## Copper pours and planes (outline as drawn; the poured copper is in the pictures)
GND on Top Layer: -2.16,56.64 87.5,56.64 87.5,-1.78 -2.16,-1.78
GND on Bottom Layer: -2.16,56.77 87.5,56.77 87.5,-1.78 -2.16,-1.78

## Text on the board
Top Silkscreen Layer: ESP8266 | DHT11 | A- | A+ | B- | B+ | E+ | E- | GND | 3V3 | 5V
